# EAGLE design SNARF-Protoboard-v03 (EAGLE 5.11)
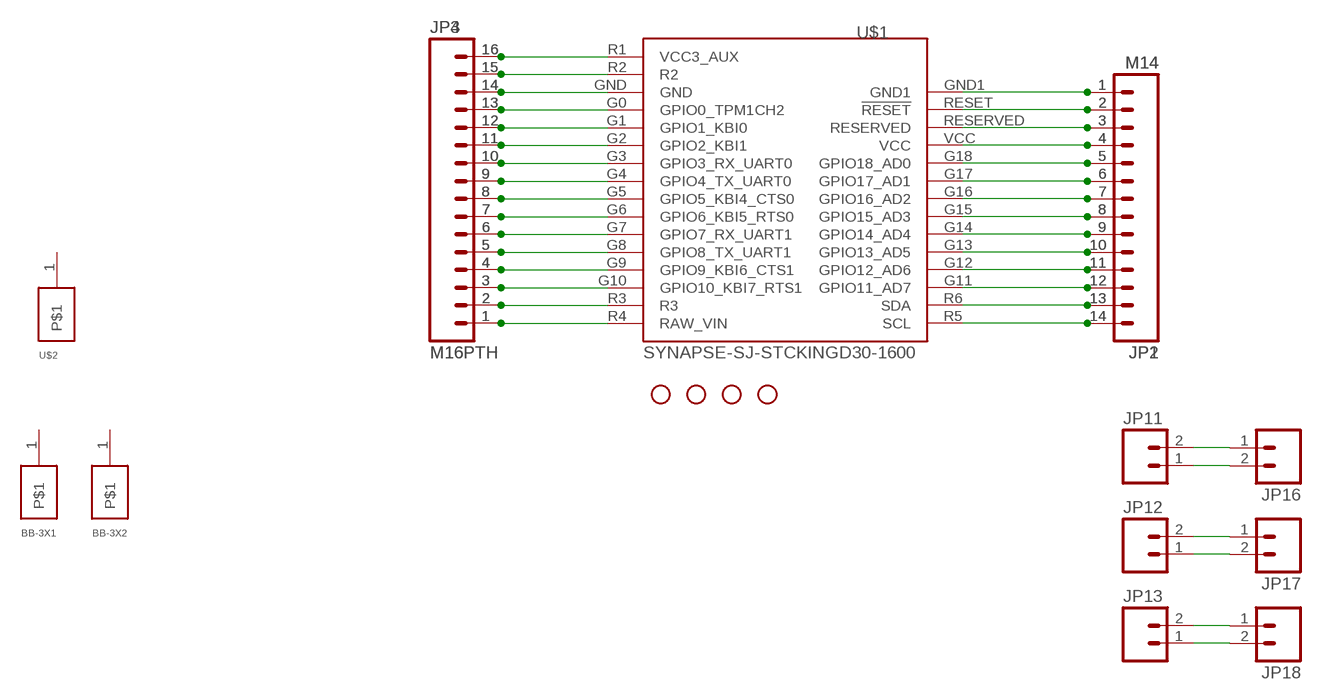
[diagram p0: schematic, sheet 1]

## Parts
BB-3X1  BREADBOARDBB-3X10  [BB-3X10]
BB-3X2  BREADBOARDBB-3X10  [BB-3X10]
JP1  M14  [1X14]
JP2  M14  [1X14]
JP3  M16PTH  [1X16]
JP4  M16PTH  [1X16]
JP7  STAND-OFF  [STAND-OFF]
JP8  STAND-OFF  [STAND-OFF]
JP9  STAND-OFF  [STAND-OFF]
JP10  STAND-OFF  [STAND-OFF]
JP11  M023.5MM  [SCREWTERMINAL-3.5MM-2]
JP12  M023.5MM  [SCREWTERMINAL-3.5MM-2]
JP13  M023.5MM  [SCREWTERMINAL-3.5MM-2]
JP16  M02PTH  [1X02]
JP17  M02PTH  [1X02]
JP18  M02PTH  [1X02]
U$1  SYNAPSE-SJ-STCKINGD30-1600  [SYNSJ-STACK]
U$2  BREADBOARDBB-2X10  [BB-2X10]

## Nets
N$1 [bigsignal]: JP1.1 JP2.1 U$1.GND1
N$2 [bigsignal]: JP1.2 JP2.2 U$1.RESET(!RESET)
N$3 [bigsignal]: JP1.3 JP2.3 U$1.RESERVED
N$4 [bigsignal]: JP1.4 JP2.4 U$1.VCC
N$5 [bigsignal]: JP1.5 JP2.5 U$1.G18(GPIO18_AD0)
N$6 [bigsignal]: JP1.6 JP2.6 U$1.G17(GPIO17_AD1)
N$7 [bigsignal]: JP1.7 JP2.7 U$1.G16(GPIO16_AD2)
N$8 [bigsignal]: JP1.8 JP2.8 U$1.G15(GPIO15_AD3)
N$9 [bigsignal]: JP1.9 JP2.9 U$1.G14(GPIO14_AD4)
N$10 [bigsignal]: JP1.10 JP2.10 U$1.G13(GPIO13_AD5)
N$11 [bigsignal]: JP1.11 JP2.11 U$1.G12(GPIO12_AD6)
N$12 [bigsignal]: JP1.12 JP2.12 U$1.G11(GPIO11_AD7)
N$13 [bigsignal]: JP1.13 JP2.13 U$1.R6(SDA)
N$14 [bigsignal]: JP1.14 JP2.14 U$1.R5(SCL)
N$15 [bigsignal]: JP3.1 JP4.1 U$1.R4(RAW_VIN)
N$16 [bigsignal]: JP3.2 JP4.2 U$1.R3
N$17 [bigsignal]: JP3.3 JP4.3 U$1.G10(GPIO10_KBI7_RTS1)
N$18 [bigsignal]: JP3.4 JP4.4 U$1.G9(GPIO9_KBI6_CTS1)
N$19 [bigsignal]: JP3.5 JP4.5 U$1.G8(GPIO8_TX_UART1)
N$20 [bigsignal]: JP3.6 JP4.6 U$1.G7(GPIO7_RX_UART1)
N$21 [bigsignal]: JP3.7 JP4.7 U$1.G6(GPIO6_KBI5_RTS0)
N$22 [bigsignal]: JP3.8 JP4.8 U$1.G5(GPIO5_KBI4_CTS0)
N$23 [bigsignal]: JP3.9 JP4.9 U$1.G4(GPIO4_TX_UART0)
N$24 [bigsignal]: JP3.10 JP4.10 U$1.G3(GPIO3_RX_UART0)
N$25 [bigsignal]: JP3.11 JP4.11 U$1.G2(GPIO2_KBI1)
N$26 [bigsignal]: JP3.12 JP4.12 U$1.G1(GPIO1_KBI0)
N$27 [bigsignal]: JP3.13 JP4.13 U$1.G0(GPIO0_TPM1CH2)
N$28 [bigsignal]: JP3.14 JP4.14 U$1.GND
N$29 [bigsignal]: JP3.15 JP4.15 U$1.R2
N$30 [bigsignal]: JP3.16 JP4.16 U$1.R1(VCC3_AUX)
N$51 [bigsignal]: JP12.2 JP17.1
N$52 [bigsignal]: JP12.1 JP17.2
N$53 [bigsignal]: JP13.2 JP18.1
N$54 [bigsignal]: JP13.1 JP18.2
N$59 [bigsignal]: JP11.2 JP16.1
N$60 [bigsignal]: JP11.1 JP16.2
Unconnected: BB-3X1.1 BB-3X2.1 U$2.1

## Library data of the parts
BB-3X1 BB-3X2 U$2 = 0_jc-custom:BREADBOARD
JP1 JP2 = SparkFun:M14: Header 14 Standard 14-pin 0.1" header. Use with straight break away headers (SKU : PRT-00116), right angle break away headers (PRT-00553), swiss pins (PRT-00743), machine pins (PRT-00117), and female headers (PRT-00115).
JP3 JP4 = SparkFun:M16
JP7-JP10 = SparkFun:STAND-OFF: Stand Off This is the mechanical footprint for a #4 phillips button head screw. Use the keepout ring to avoid running the screw head into surrounding components. SKU : PRT-00447
JP11-JP13 JP16-JP18 = SparkFun:M02: Header 2 Standard 2-pin 0.1" header. Use with straight break away headers (SKU : PRT-00116), right angle break away headers (PRT-00553), swiss pins (PRT-00743), machine pins (PRT-00117), and female headers (PRT-00115). Molex polarized connector foot print use with SKU : PRT-08233 with associated crimp pins and housings.
U$1 = 0_jc-custom:SYNAPSE-SJ-STCKING: Standard layout for expansion modules using Synapse Wireless boards

## Net classes
0 default: width 0.152 mm
1 bigsignal: width 0.508 mm

## Board
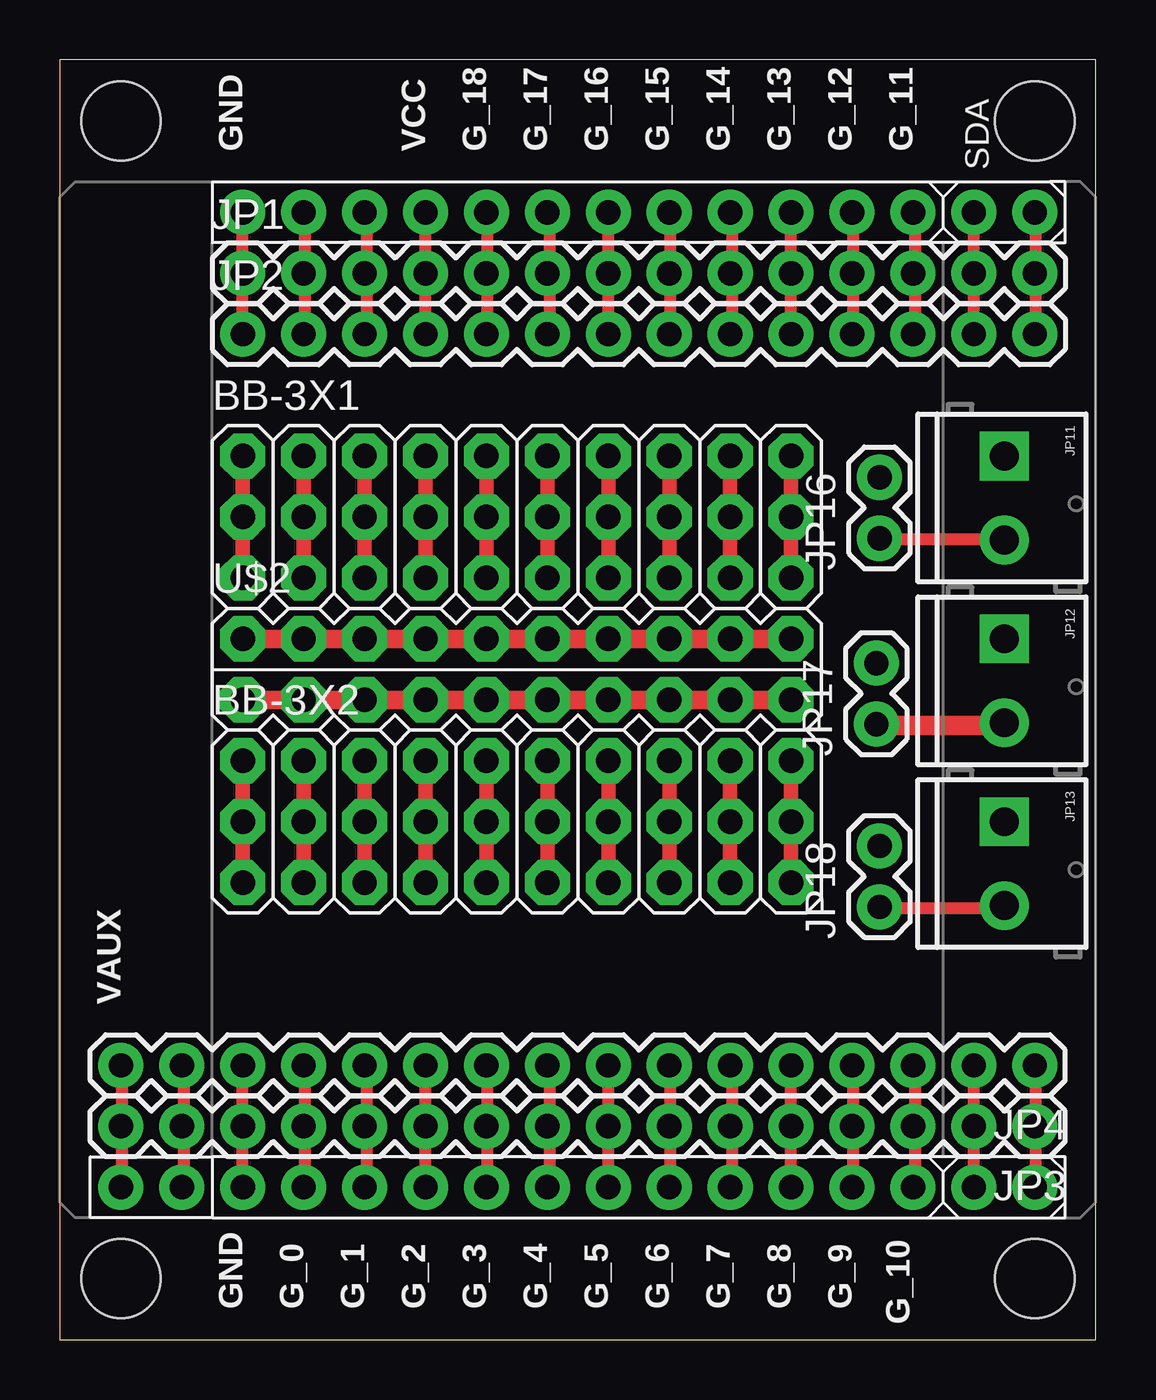
[diagram p1: board, top side]
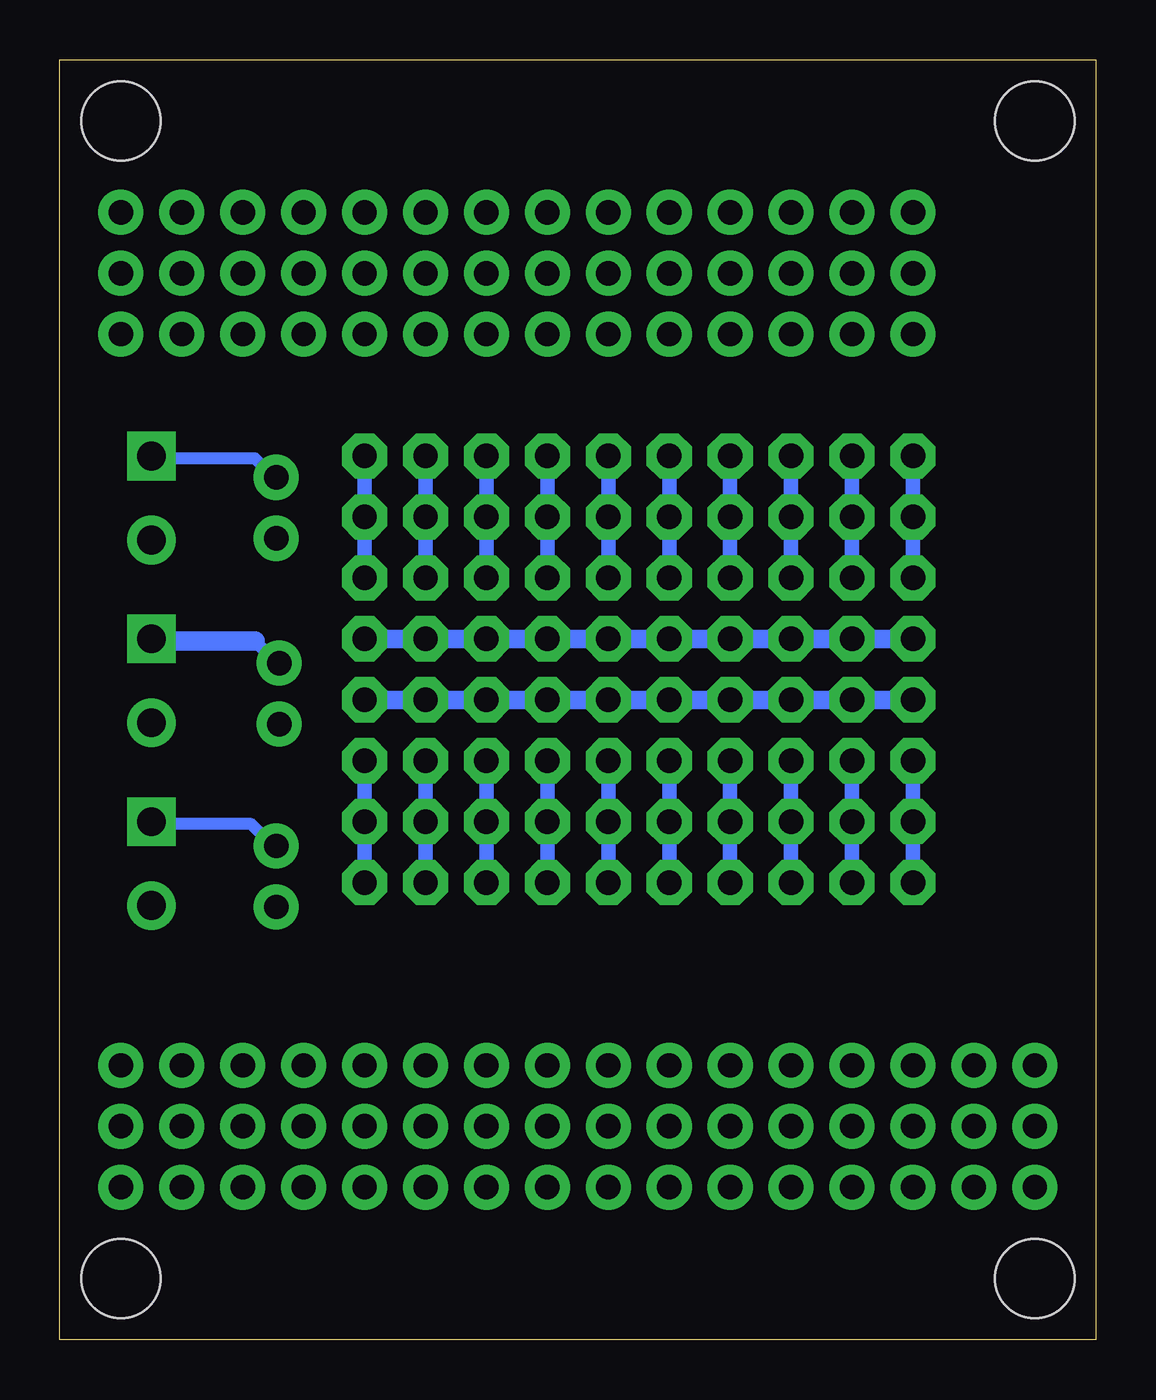
[diagram p2: board, bottom side, seen from below]

Size 43.18 x 53.34 mm. Coordinates in mm from the lower left corner, seen from the top.
Outline: 0,0 43.18,0 43.18,53.34 0,53.34 0,0
Copper layers (1*16): Top 0.0356mm / dielectric 1.5011mm / Bottom 0.0356mm
Design rules "LaenPCBOrder-JCModified": minimum track width 6mil, minimum drill 13mil, track to track 6mil, track to pad 6mil, pad to pad 6mil, via to via 6mil, smd to smd 6mil, copper to edge 15mil, drill to drill 6mil, minimum pad ring 12mil, minimum via ring 7mil, stop-mask expansion 4mil, vias tented up to drill 25mil, thermal gap 10mil

### Footprints (pad centres in the part's own frame; a part is rotated, then mirrored left to right if it is on the bottom)
BB-3X10 = drill 1.016 pad 1.88 octagon: 1 -11.43,-3.81; 2 -11.43,1.27; 3 -8.89,-3.81; 4 -8.89,1.27; 5 -6.35,-3.81; 6 -6.35,1.27; 7 -3.81,-3.81; 8 -3.81,1.27; 9 -1.27,-3.81; 10 -1.27,1.27; 11 1.27,-3.81; 12 1.27,1.27; 13 3.81,-3.81; 14 3.81,1.27; 15 6.35,-3.81; 16 6.35,1.27; 17 8.89,-3.81; 18 8.89,1.27; 19 11.43,-3.81; 20 11.43,1.27; 21 -11.43,-1.27; 22 -8.89,-1.27; 23 -6.35,-1.27; 24 -3.81,-1.27; 25 -1.27,-1.27; 26 1.27,-1.27; 27 3.81,-1.27; 28 6.35,-1.27; 29 8.89,-1.27; 30 11.43,-1.27
1X14 = drill 1.016 pad 1.88 round: 1 0,0; 2 2.54,0; 3 5.08,0; 4 7.62,0; 5 10.16,0; 6 12.7,0; 7 15.24,0; 8 17.78,0; 9 20.32,0; 10 22.86,0; 11 25.4,0; 12 27.94,0; 13 30.48,0; 14 33.02,0
1X16 = drill 1.016 pad 1.88 round: 1 0,0; 2 2.54,0; 3 5.08,0; 4 7.62,0; 5 10.16,0; 6 12.7,0; 7 15.24,0; 8 17.78,0; 9 20.32,0; 10 22.86,0; 11 25.4,0; 12 27.94,0; 13 30.48,0; 14 33.02,0; 15 35.56,0; 16 38.1,0
STAND-OFF = hole 3.302: 0,0
SCREWTERMINAL-3.5MM-2 = drill 1.2 pad 2.032 square: 1 0,0 | drill 1.2 pad 2.032 round: 2 3.5,0
1X02 = drill 1.016 pad 1.88 round: 1 0,0; 2 2.54,0
SYNSJ-STACK = drill 1.016 pad 1.88 round: G0 0,-7.62; G1 0,-10.16; G2 0,-12.7; G3 0,-15.24; G4 0,-17.78; G5 0,-20.32; G6 0,-22.86; G7 0,-25.4; G8 0,-27.94; G9 0,-30.48; G10 0,-33.02; G11 40.64,-33.02; G12 40.64,-30.48; G13 40.64,-27.94; G14 40.64,-25.4; G15 40.64,-22.86; G16 40.64,-20.32; G17 40.64,-17.78; G18 40.64,-15.24; GND 0,-5.08; GND1 40.64,-5.08; R1 0,0; R2 0,-2.54; R3 0,-35.56; R4 0,-38.1; R5 40.64,-38.1; R6 40.64,-35.56; RESERVED 40.64,-10.16; RESET 40.64,-7.62; VCC 40.64,-12.7
BB-2X10 = drill 1.016 pad 1.88 octagon: 1 -11.43,-1.27; 2 -11.43,1.27; 3 -8.89,-1.27; 4 -8.89,1.27; 5 -6.35,-1.27; 6 -6.35,1.27; 7 -3.81,-1.27; 8 -3.81,1.27; 9 -1.27,-1.27; 10 -1.27,1.27; 11 1.27,-1.27; 12 1.27,1.27; 13 3.81,-1.27; 14 3.81,1.27; 15 6.35,-1.27; 16 6.35,1.27; 17 8.89,-1.27; 18 8.89,1.27; 19 11.43,-1.27; 20 11.43,1.27

### Placement (x,y rotation side)
BB-3X1  19.05,35.56 0 top
BB-3X2  19.05,22.86 0 top
JP1  7.62,44.45 0 top
JP2  7.62,41.91 0 top
JP3  40.64,8.89 180 top
JP4  40.64,11.43 180 top
JP7  2.54,2.54 0 top
JP8  40.64,2.54 0 top
JP9  2.54,50.8 0 top
JP10  40.64,50.8 0 top
JP11  39.37,36.83 270 top
JP12  39.37,29.21 270 top
JP13  39.37,21.59 270 top
JP16  34.16,33.4 90 top
JP17  34.04,25.65 90 top
JP18  34.16,18.03 90 top
U$1  2.54,6.35 90 top
U$2  19.05,27.94 0 top

### Tracks (layer width: path | path; a pad name or v marks a point on that pad's centre or on a via)
N$1
  Top 0.508: JP2.1 7.62,44.35 JP1.1 7.62,44.65 7.62,46.94 U$1.GND1
N$2
  Top 0.508: JP2.2 10.21,41.91 10.21,44.35 JP1.2 10.21,44.65 10.21,46.94 U$1.RESET
N$3
  Top 0.508: JP2.3 12.8,41.91 12.8,44.35 JP1.3 12.8,44.65 12.8,46.94 U$1.RESERVED
N$4
  Top 0.508: JP2.4 15.24,44.35 JP1.4 15.24,44.65 15.24,46.94 U$1.VCC
N$5
  Top 0.508: JP2.5 17.83,41.91 17.83,44.35 JP1.5 17.83,44.65 17.83,46.94 U$1.G18
N$6
  Top 0.508: JP2.6 20.42,41.91 20.42,44.35 JP1.6 20.42,44.65 20.42,46.94 U$1.G17
N$7
  Top 0.508: JP2.7 22.86,44.35 JP1.7 22.86,44.65 22.86,46.94 U$1.G16
N$8
  Top 0.508: JP2.8 25.45,41.91 25.45,44.35 JP1.8 25.45,44.65 25.45,46.94 U$1.G15
N$9
  Top 0.508: JP2.9 28.04,41.91 28.04,44.35 JP1.9 28.04,44.65 28.04,46.94 U$1.G14
N$10
  Top 0.508: JP2.10 30.48,44.35 JP1.10 30.48,44.65 30.48,46.94 U$1.G13
N$11
  Top 0.508: JP2.11 33.07,41.91 33.07,44.35 JP1.11 33.07,44.65 33.07,46.94 U$1.G12
N$12
  Top 0.508: JP2.12 35.66,41.91 35.66,44.35 JP1.12 35.66,44.65 35.66,46.94 U$1.G11
N$13
  Top 0.508: JP2.13 38.1,44.35 JP1.13 38.1,44.65 38.1,46.94 U$1.R6
N$14
  Top 0.508: JP2.14 40.69,41.91 40.69,44.35 JP1.14 40.69,44.65 40.69,46.94 U$1.R5
N$15
  Top 0.508: U$1.R4 40.69,6.4 40.69,8.84 JP3.1 40.69,8.99 40.69,11.43 JP4.1
N$16
  Top 0.508: U$1.R3 38.1,6.4 38.1,8.84 JP3.2 38.1,8.99 JP4.2
N$17
  Top 0.508: U$1.G10 35.66,6.4 35.66,8.84 JP3.3 35.66,8.99 35.66,11.43 JP4.3
N$18
  Top 0.508: U$1.G9 33.07,6.4 33.07,8.84 JP3.4 33.07,8.99 33.07,11.43 JP4.4
N$19
  Top 0.508: U$1.G8 30.48,6.4 30.48,8.84 JP3.5 30.48,8.99 JP4.5
N$20
  Top 0.508: U$1.G7 28.04,6.4 28.04,8.84 JP3.6 28.04,8.99 28.04,11.43 JP4.6
N$21
  Top 0.508: U$1.G6 25.45,6.4 25.45,8.84 JP3.7 25.45,8.99 25.45,11.43 JP4.7
N$22
  Top 0.508: U$1.G5 22.86,6.4 22.86,8.84 JP3.8 22.86,8.99 JP4.8
N$23
  Top 0.508: U$1.G4 20.42,6.4 20.42,8.84 JP3.9 20.42,8.99 20.42,11.43 JP4.9
N$24
  Top 0.508: U$1.G3 17.83,6.4 17.83,8.84 JP3.10 17.83,8.99 17.83,11.43 JP4.10
N$25
  Top 0.508: U$1.G2 15.24,6.4 15.24,8.84 JP3.11 15.24,8.99 JP4.11
N$26
  Top 0.508: U$1.G1 12.8,6.4 12.8,8.84 JP3.12 12.8,8.99 12.8,11.43 JP4.12
N$27
  Top 0.508: U$1.G0 10.21,6.4 10.21,8.84 JP3.13 10.21,8.99 10.21,11.43 JP4.13
N$28
  Top 0.508: U$1.GND 7.62,6.4 7.62,8.84 JP3.14 7.62,8.99 JP4.14
N$29
  Top 0.508: U$1.R2 5.18,6.4 5.18,8.84 JP3.15 5.18,8.99 5.18,11.43 JP4.15
N$30
  Top 0.508: U$1.R1 2.59,6.4 2.59,8.84 JP3.16 2.59,8.99 2.59,11.43 JP4.16
N$51
  Top 0.508: JP17.1 34.14,25.6 | 39.32,25.6 JP12.2
  Top 0.813: 34.14,25.6 39.32,25.6
N$52
  Bottom 0.508: 35.05,29.11 34.14,28.19 JP17.2 | 39.32,29.11 JP12.1
  Bottom 0.813: 35.05,29.11 39.32,29.11
N$53
  Top 0.508: JP18.1 34.29,17.98 39.32,17.98 JP13.2
N$54
  Bottom 0.508: JP18.2 34.29,20.57 35.2,21.49 39.32,21.49 JP13.1
N$59
  Top 0.508: JP16.1 34.29,33.38 39.32,33.38 JP11.2
N$60
  Bottom 0.508: JP16.2 34.29,35.97 35.05,36.73 39.32,36.73 JP11.1

### Text on the board
tPlace: GND | VCC | G_18 | G_17 | G_16 | G_15 | G_14 | G_13 | G_12 | G_11 | SDA | VAUX | GND | G_0 | G_1 | G_2 | G_3 | G_4 | G_5 | G_6 | G_7 | G_8 | G_9 | G_10